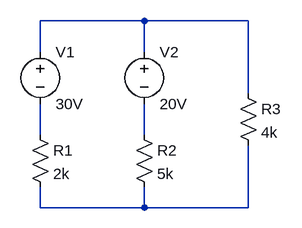
[diagram p0: schematic Draft3.asc]
Draft3.asc, the LTspice schematic file:
Version 4
SHEET 1 880 680
WIRE 256 0 96 0
WIRE 416 0 256 0
WIRE 96 48 96 0
WIRE 256 48 256 0
WIRE 416 112 416 0
WIRE 96 176 96 128
WIRE 256 176 256 128
WIRE 96 288 96 256
WIRE 256 288 256 256
WIRE 256 288 96 288
WIRE 416 288 416 192
WIRE 416 288 256 288
SYMBOL voltage 96 32 R0
SYMATTR InstName V1
SYMATTR Value 30V
SYMBOL res 80 160 R0
SYMATTR InstName R1
SYMATTR Value 2k
SYMBOL res 240 160 R0
SYMATTR InstName R2
SYMATTR Value 5k
SYMBOL voltage 256 32 R0
SYMATTR InstName V2
SYMATTR Value 20V
SYMBOL res 400 96 R0
SYMATTR InstName R3
SYMATTR Value 4k

The netlist it stands for:
* Draft3.asc
V1 N001 N002 30V
R1 N002 N004 2k
R2 N003 N004 5k
V2 N001 N003 20V
R3 N001 N004 4k
.backanno
.end